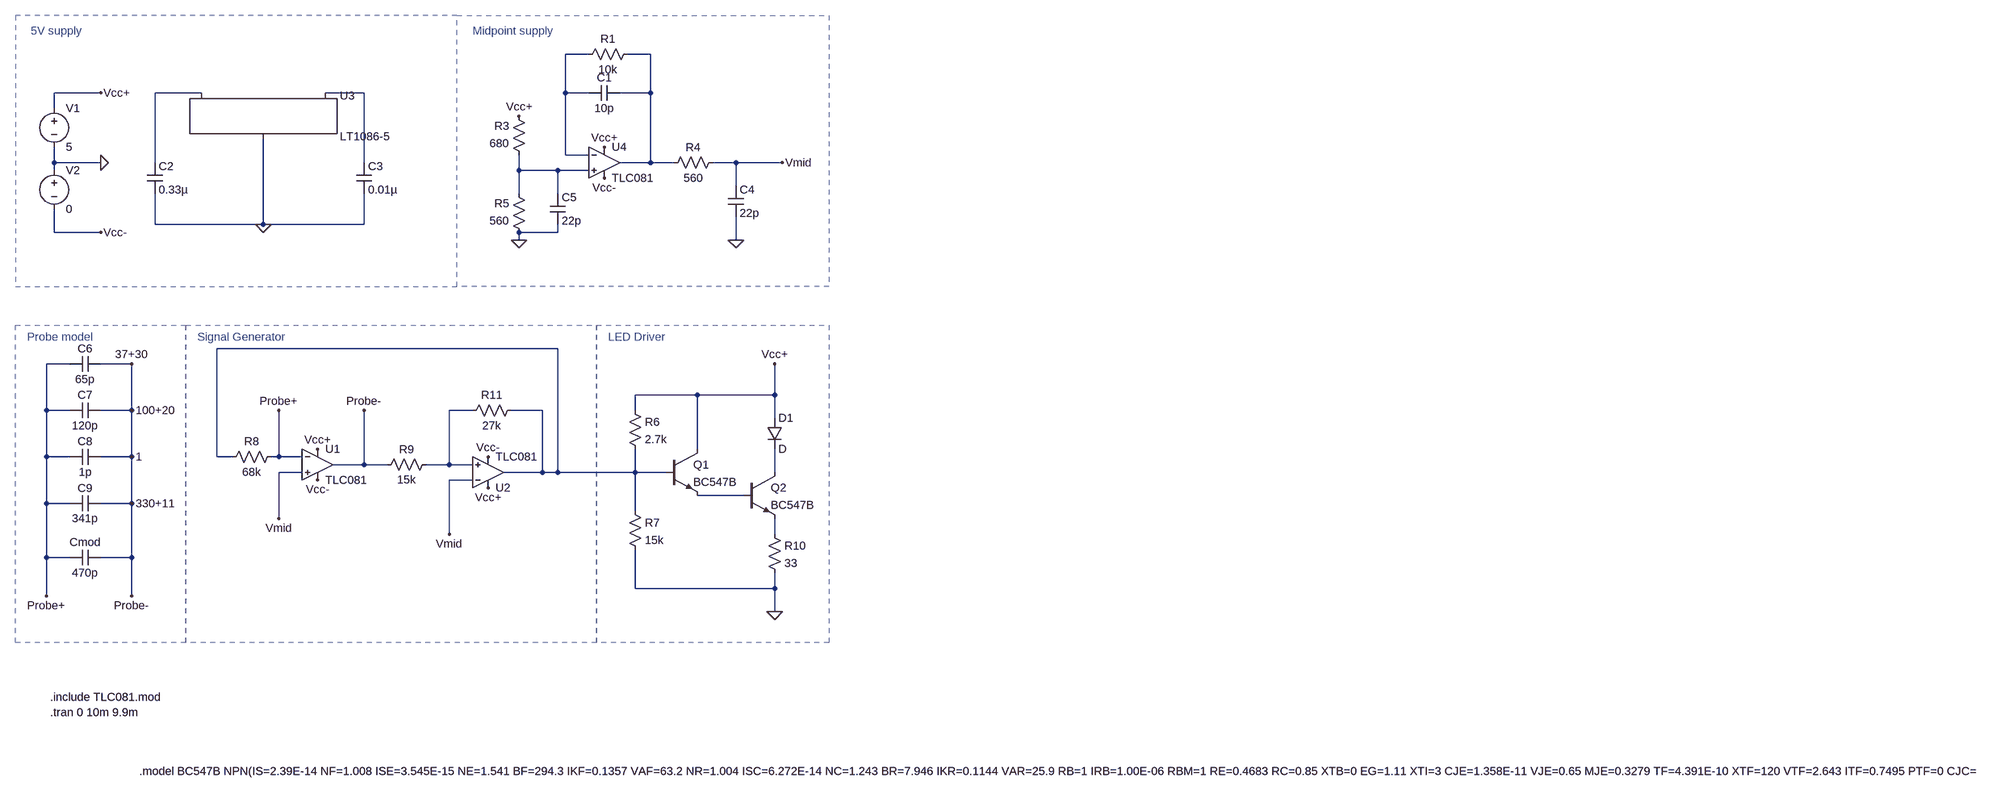
[diagram p0: schematic Phase-2-hardware-design.asc]
Phase-2-hardware-design.asc, the LTspice schematic file:
Version 4
SHEET 1 6580 960
WIRE 256 -864 208 -864
WIRE 384 -864 336 -864
WIRE -752 -784 -848 -784
WIRE -544 -784 -640 -784
WIRE -208 -784 -288 -784
WIRE 208 -784 208 -864
WIRE 256 -784 208 -784
WIRE 384 -784 384 -864
WIRE 384 -784 320 -784
WIRE -848 -752 -848 -784
WIRE 208 -656 208 -784
WIRE 256 -656 208 -656
WIRE -848 -640 -848 -672
WIRE -752 -640 -848 -640
WIRE -640 -640 -640 -784
WIRE -208 -640 -208 -784
WIRE 384 -640 384 -784
WIRE 384 -640 320 -640
WIRE 432 -640 384 -640
WIRE 560 -640 512 -640
WIRE 656 -640 560 -640
WIRE -848 -624 -848 -640
WIRE 112 -624 112 -656
WIRE 192 -624 112 -624
WIRE 256 -624 192 -624
WIRE 560 -592 560 -640
WIRE 112 -576 112 -624
WIRE 192 -576 192 -624
WIRE -640 -512 -640 -576
WIRE -416 -512 -416 -688
WIRE -416 -512 -640 -512
WIRE -208 -512 -208 -576
WIRE -208 -512 -416 -512
WIRE -848 -496 -848 -544
WIRE -752 -496 -848 -496
WIRE 192 -496 192 -512
WIRE 192 -496 112 -496
WIRE 112 -480 112 -496
WIRE 560 -480 560 -528
WIRE 192 -256 -512 -256
WIRE -816 -224 -864 -224
WIRE -688 -224 -752 -224
WIRE 480 -160 352 -160
WIRE 640 -160 640 -224
WIRE 640 -160 480 -160
WIRE -864 -128 -864 -224
WIRE -816 -128 -864 -128
WIRE -688 -128 -688 -224
WIRE -688 -128 -752 -128
WIRE 16 -128 -32 -128
WIRE 160 -128 96 -128
WIRE 352 -128 352 -160
WIRE 640 -112 640 -160
WIRE 480 -48 480 -160
WIRE -864 -32 -864 -128
WIRE -816 -32 -864 -32
WIRE -688 -32 -688 -128
WIRE -688 -32 -752 -32
WIRE -512 -32 -512 -256
WIRE -480 -32 -512 -32
WIRE -384 -32 -384 -128
WIRE -384 -32 -400 -32
WIRE -336 -32 -384 -32
WIRE -208 -16 -208 -128
WIRE -208 -16 -272 -16
WIRE -160 -16 -208 -16
WIRE -32 -16 -32 -128
WIRE -32 -16 -80 -16
WIRE 16 -16 -32 -16
WIRE -336 0 -384 0
WIRE 160 0 160 -128
WIRE 160 0 80 0
WIRE 192 0 192 -256
WIRE 192 0 160 0
WIRE 352 0 352 -48
WIRE 352 0 192 0
WIRE 416 0 352 0
WIRE 640 0 640 -48
WIRE 16 16 -32 16
WIRE 576 48 480 48
WIRE -864 64 -864 -32
WIRE -816 64 -864 64
WIRE -688 64 -688 -32
WIRE -688 64 -752 64
WIRE 352 80 352 0
WIRE -384 96 -384 0
WIRE -32 128 -32 16
WIRE 640 128 640 96
WIRE -864 176 -864 64
WIRE -816 176 -864 176
WIRE -688 176 -688 64
WIRE -688 176 -752 176
WIRE 352 240 352 160
WIRE 640 240 640 208
WIRE 640 240 352 240
WIRE -864 256 -864 176
WIRE -688 256 -688 176
WIRE 640 288 640 240
FLAG -752 -640 0
FLAG -752 -784 Vcc+
FLAG -752 -496 Vcc-
FLAG -304 -48 Vcc+
FLAG 48 32 Vcc+
FLAG -304 16 Vcc-
FLAG 48 -32 Vcc-
FLAG 640 288 0
FLAG 640 -224 Vcc+
FLAG -416 -512 0
FLAG 112 -736 Vcc+
FLAG 288 -672 Vcc+
FLAG 288 -608 Vcc-
FLAG 560 -480 0
FLAG 112 -480 0
FLAG -688 -128 100+20
FLAG -688 -224 37+30
FLAG -688 -32 1
FLAG -688 64 330+11
FLAG -384 96 Vmid
FLAG -32 128 Vmid
FLAG 656 -640 Vmid
FLAG -384 -128 Probe+
FLAG -864 256 Probe+
FLAG -208 -128 Probe-
FLAG -688 256 Probe-
SYMBOL OpAmps\\opamp2 -304 -80 R0
SYMATTR InstName U1
SYMATTR Value TLC081
SYMBOL OpAmps\\opamp2 48 64 M180
SYMATTR InstName U2
SYMATTR Value TLC081
SYMBOL voltage -848 -768 R0
WINDOW 123 0 0 Left 0
WINDOW 39 0 0 Left 0
SYMATTR InstName V1
SYMATTR Value 5
SYMBOL voltage -848 -640 R0
WINDOW 123 0 0 Left 0
WINDOW 39 0 0 Left 0
SYMATTR InstName V2
SYMATTR Value 0
SYMBOL res -384 -48 R90
WINDOW 0 0 56 VBottom 2
WINDOW 3 32 56 VTop 2
SYMATTR InstName R8
SYMATTR Value 68k
SYMBOL res -64 -32 R90
WINDOW 0 0 56 VBottom 2
WINDOW 3 32 56 VTop 2
SYMATTR InstName R9
SYMATTR Value 15k
SYMBOL res 112 -144 R90
WINDOW 0 0 56 VBottom 2
WINDOW 3 32 56 VTop 2
SYMATTR InstName R11
SYMATTR Value 27k
SYMBOL cap -752 160 R90
WINDOW 0 0 32 VBottom 2
WINDOW 3 32 32 VTop 2
SYMATTR InstName Cmod
SYMATTR Value 470p
SYMBOL res 336 64 R0
SYMATTR InstName R7
SYMATTR Value 15k
SYMBOL npn2 416 -48 R0
SYMATTR InstName Q1
SYMATTR Value BC547B
SYMBOL npn2 576 0 R0
SYMATTR InstName Q2
SYMATTR Value BC547B
SYMBOL res 624 112 R0
SYMATTR InstName R10
SYMATTR Value 33
SYMBOL res 336 -144 R0
SYMATTR InstName R6
SYMATTR Value 2.7k
SYMBOL cap -752 48 R90
WINDOW 0 0 32 VBottom 2
WINDOW 3 32 32 VTop 2
SYMATTR InstName C9
SYMATTR Value 341p
SYMBOL cap -752 -48 R90
WINDOW 0 0 32 VBottom 2
WINDOW 3 32 32 VTop 2
SYMATTR InstName C8
SYMATTR Value 1p
SYMBOL cap -752 -144 R90
WINDOW 0 0 32 VBottom 2
WINDOW 3 32 32 VTop 2
SYMATTR InstName C7
SYMATTR Value 120p
SYMBOL cap -752 -240 R90
WINDOW 0 0 32 VBottom 2
WINDOW 3 32 32 VTop 2
SYMATTR InstName C6
SYMATTR Value 65p
SYMBOL cap -656 -640 R0
SYMATTR InstName C2
SYMATTR Value 0.33µ
SYMBOL cap -224 -640 R0
SYMATTR InstName C3
SYMATTR Value 0.01µ
SYMBOL PowerProducts\\LT1086-5 -416 -784 R0
SYMATTR InstName U3
SYMBOL OpAmps\\opamp2 288 -704 R0
SYMATTR InstName U4
SYMATTR Value TLC081
SYMBOL res 352 -880 R90
WINDOW 0 0 56 VBottom 2
WINDOW 3 32 56 VTop 2
SYMATTR InstName R1
SYMATTR Value 10k
SYMBOL res 128 -640 R180
WINDOW 0 36 76 Left 2
WINDOW 3 36 40 Left 2
SYMATTR InstName R3
SYMATTR Value 680
SYMBOL res 416 -624 R270
WINDOW 0 32 56 VTop 2
WINDOW 3 0 56 VBottom 2
SYMATTR InstName R4
SYMATTR Value 560
SYMBOL res 128 -480 R180
WINDOW 0 36 76 Left 2
WINDOW 3 36 40 Left 2
SYMATTR InstName R5
SYMATTR Value 560
SYMBOL cap 320 -800 R90
WINDOW 0 0 32 VBottom 2
WINDOW 3 32 32 VTop 2
SYMATTR InstName C1
SYMATTR Value 10p
SYMBOL cap 544 -592 R0
SYMATTR InstName C4
SYMATTR Value 22p
SYMBOL cap 176 -576 R0
SYMATTR InstName C5
SYMATTR Value 22p
SYMBOL diode 624 -112 R0
SYMATTR InstName D1
TEXT -856 536 Left 2 !.include TLC081.mod
TEXT -856 568 Left 2 !.tran 0 10m 9.9m
TEXT -672 896 Left 2 !.model BC547B NPN(IS=2.39E-14 NF=1.008 ISE=3.545E-15 NE=1.541 BF=294.3 IKF=0.1357 VAF=63.2 NR=1.004 ISC=6.272E-14 NC=1.243 BR=7.946 IKR=0.1144 VAR=25.9 RB=1 IRB=1.00E-06 RBM=1 RE=0.4683 RC=0.85 XTB=0 EG=1.11 XTI=3 CJE=1.358E-11 VJE=0.65 MJE=0.3279 TF=4.391E-10 XTF=120 VTF=2.643 ITF=0.7495 PTF=0 CJC=3.728E-12 VJC=0.3997 MJC=0.2955 XCJC=0.6193 TR=1.00E-32 CJS=0 VJS=0.75 MJS=0.333 FC=0.9579 Vceo=45 Icrating=100m mfg=Philips)
TEXT -552 -280 Left 2 ;Signal Generator
TEXT 296 -280 Left 2 ;LED Driver
TEXT -904 -280 Left 2 ;Probe model
TEXT -896 -912 Left 2 ;5V supply
TEXT 16 -912 Left 2 ;Midpoint supply
RECTANGLE Normal 752 -384 -16 -944 2
RECTANGLE Normal -576 352 -928 -304 2
RECTANGLE Normal 272 352 -576 -304 2
RECTANGLE Normal 752 352 272 -304 2
RECTANGLE Normal -928 -384 -16 -944 2

The netlist it stands for:
* Phase-2-hardware-design.asc
XU1 Vmid Probe+ Vcc+ Vcc- Probe- TLC081  ; pins In+ In- V+ V- OUT
XU2 N007 Vmid Vcc+ Vcc- N006 TLC081  ; pins In+ In- V+ V- OUT
V1 Vcc+ 0 5
V2 0 Vcc- 0
R8 Probe+ N006 68k
R9 N007 Probe- 15k
R11 N006 N007 27k
Cmod Probe- Probe+ 470p
R7 N006 0 15k
Q1 Vcc+ N006 N009 0 BC547B
Q2 N008 N009 N010 0 BC547B
R10 N010 0 33
R6 Vcc+ N006 2.7k
C9 Probe- Probe+ 341p
C8 Probe- Probe+ 1p
C7 Probe- Probe+ 120p
C6 Probe- Probe+ 65p
C2 N003 0 0.33µ
C3 N004 0 0.01µ
XU3 0 N004 N003 LT1086-5
XU4 N005 N001 Vcc+ Vcc- N002 TLC081  ; pins In+ In- V+ V- OUT
R1 N002 N001 10k
R3 N005 Vcc+ 680
R4 N002 Vmid 560
R5 0 N005 560
C1 N002 N001 10p
C4 Vmid 0 22p
C5 N005 0 22p
D1 Vcc+ N008 D
.model D D
.lib standard.dio
.model NPN NPN
.model PNP PNP
.lib standard.bjt
.include TLC081.mod
.tran 0 10m 9.9m
.model BC547B NPN(IS=2.39E-14 NF=1.008 ISE=3.545E-15 NE=1.541 BF=294.3 IKF=0.1357 VAF=63.2 NR=1.004 ISC=6.272E-14 NC=1.243 BR=7.946 IKR=0.1144 VAR=25.9 RB=1 IRB=1.00E-06 RBM=1 RE=0.4683 RC=0.85 XTB=0 EG=1.11 XTI=3 CJE=1.358E-11 VJE=0.65 MJE=0.3279 TF=4.391E-10 XTF=120 VTF=2.643 ITF=0.7495 PTF=0 CJC=3.728E-12 VJC=0.3997 MJC=0.2955 XCJC=0.6193 TR=1.00E-32 CJS=0 VJS=0.75 MJS=0.333 FC=0.9579 Vceo=45 Icrating=100m mfg=Philips)
* Signal Generator
* LED Driver
* Probe model
* 5V supply
* Midpoint supply
.backanno
.end